# Altium project CompoundPeripheral.PrjPCB
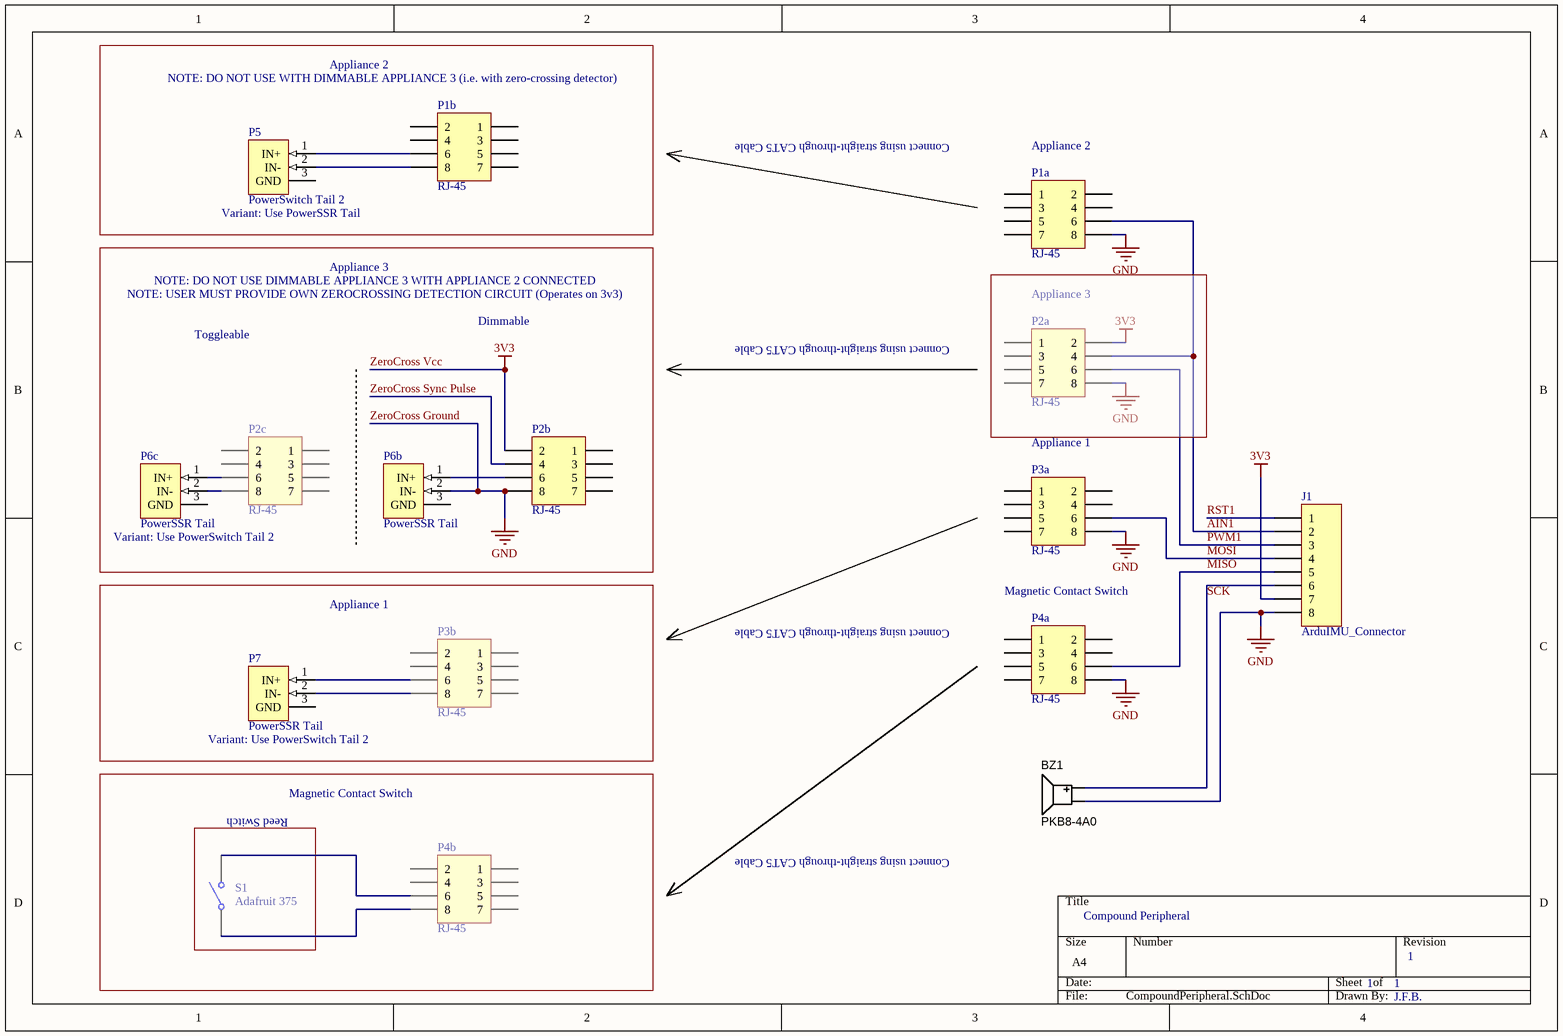
[diagram p0: CompoundPeripheral.SchDoc]
2 sheets, 30 parts. Net scope: global (net labels, ports and power ports of the same name join across sheets).
Sheets:
  CompoundPeripheral.SchDoc
  ZeroCrossDetector.SchDoc

## Sheet CompoundPeripheral.SchDoc: Compound Peripheral
size A4; DrawnBy: J.F.B.; Revision: 1; SheetNumber: 1; SheetTotal: 1

### Parts
BZ1  PKB8-4A0  [BUZZER_12.0X8.5MM]
J1  ArduIMU_Connector  [HDR1X8]
P1a  RJ-45  [HDR2X4]
P1b  RJ-45  [HDR2X4]
P2a  RJ-45  [HDR2X4]
P2b  RJ-45  [HDR2X4]
P2c  RJ-45  [HDR2X4]
P3a  RJ-45  [HDR2X4]
P3b  RJ-45  [HDR2X4]
P4a  RJ-45  [HDR2X4]
P4b  RJ-45  [HDR2X4]
P5  PowerSwitch Tail 2
P6b  PowerSSR Tail
P6c  PowerSSR Tail
P7  PowerSSR Tail
S1  Adafruit 375  [SPST-2]

### Blocks framed on the sheet
Appliance 3: P2a
Magnetic Contact Switch: P4b
Reed Switch: S1

### Nets
ZeroCross Ground: BZ1.2(Negative) J1.8 P1a.8 P2a.8 P2b.8 P3a.8 P4a.8 P6b.2(IN-)  [also labelled GND]
ZeroCross Vcc: J1.7 P2a.2 P2b.2  [also labelled 3V3]
AIN1: J1.2 P1a.6 P2a.4
MISO: J1.5 P4a.6
MOSI: J1.4 P3a.6
PWM1: J1.3 P2a.6
RST1: J1.1
SCK: BZ1.1(Positive) J1.6
ZeroCross Sync Pulse: P2b.4
NetP1b_6: P1b.6 P5.1(IN+)
NetP1b_8: P1b.8 P5.2(IN-)
NetP2b_6: P2b.6 P6b.1(IN+)
NetP2c_6: P2c.6 P6c.1(IN+)
NetP2c_8: P2c.8 P6c.2(IN-)
NetP3b_6: P3b.6 P7.1(IN+)
NetP3b_8: P3b.8 P7.2(IN-)
NetP4b_6: P4b.6 S1.2(NO)
NetP4b_8: P4b.8 S1.1(COMMON)

Not connected (* = marked no-connect by the designer): P1a 1 2 3 4 5 7; P1b 1 2 3 4 5 7; P2a 1 3 5 7; P2b 1 3 5 7; P2c 1 2 3 4 5 7; P3a 1 2 3 4 5 7; P3b 1 2 3 4 5 7; P4a 1 2 3 4 5 7; P4b 1 2 3 4 5 7; P5 3(GND); P6b 3(GND); P6c 3(GND); P7 3(GND)

### Notes on the sheet
- (near P1b) NOTE: DO NOT USE WITH DIMMABLE APPLIANCE 3 (i.e. with zero-crossing detector)
- Appliance 2
- Connect using straight-through CAT5 Cable
- (near P1a) Appliance 2
- (near P5) Variant: Use PowerSSR Tail
- NOTE: USER MUST PROVIDE OWN ZEROCROSSING DETECTION CIRCUIT (Operates on 3v3)
- NOTE: DO NOT USE DIMMABLE APPLIANCE 3 WITH APPLIANCE 2 CONNECTED
- Appliance 3
- Toggleable
- Dimmable
- Appliance 1
- Variant: Use PowerSwitch Tail 2
- Magnetic Contact Switch
- (near P7) Variant: Use PowerSwitch Tail 2

### Library data of the parts
BZ1 = BZ_12x8.5x6.5_2kHz: Speaker, Magnetic Transducer; Manufacturer 1: CUI Inc; Ratings: 2048 ±200 Hz; SCDType: source; Package / Case: 6.5mm pitch; Material: Noryl SE1-J; Supplier 1: Digi-Key; Supplier Part Number 1: 102-1152-ND; Manufacturer Part Number 1: PKB8-4A0
J1 = Header 8: Header, 8-Pin; LatestRevisionDate: 17-Jul-2002; LatestRevisionNote: Re-released for DXP Platform.; Publisher: Altium Limited
P1a P1b P2a P2b P2c P3a P3b P4a P4b = Header 4X2: Header, 4-Pin, Dual row; LatestRevisionDate: 17-Jul-2002; LatestRevisionNote: Re-released for DXP Platform.; Publisher: Altium Limited
S1 = SW-SPST: Single-Pole, Single-Throw Switch; Published: 24-Mar-1999; LatestRevisionDate: 17-Jul-2002; LatestRevisionNote: Re-released for DXP Platform.; PackageReference: SPST-2; Publisher: Altium Limited; PackageDescription: Switch; 2 Leads

## Sheet ZeroCrossDetector.SchDoc: Zero-Crossing Detector
size A4; DrawnBy: J.F.B.; Revision: 2; SheetNumber: 1; SheetTotal: 1
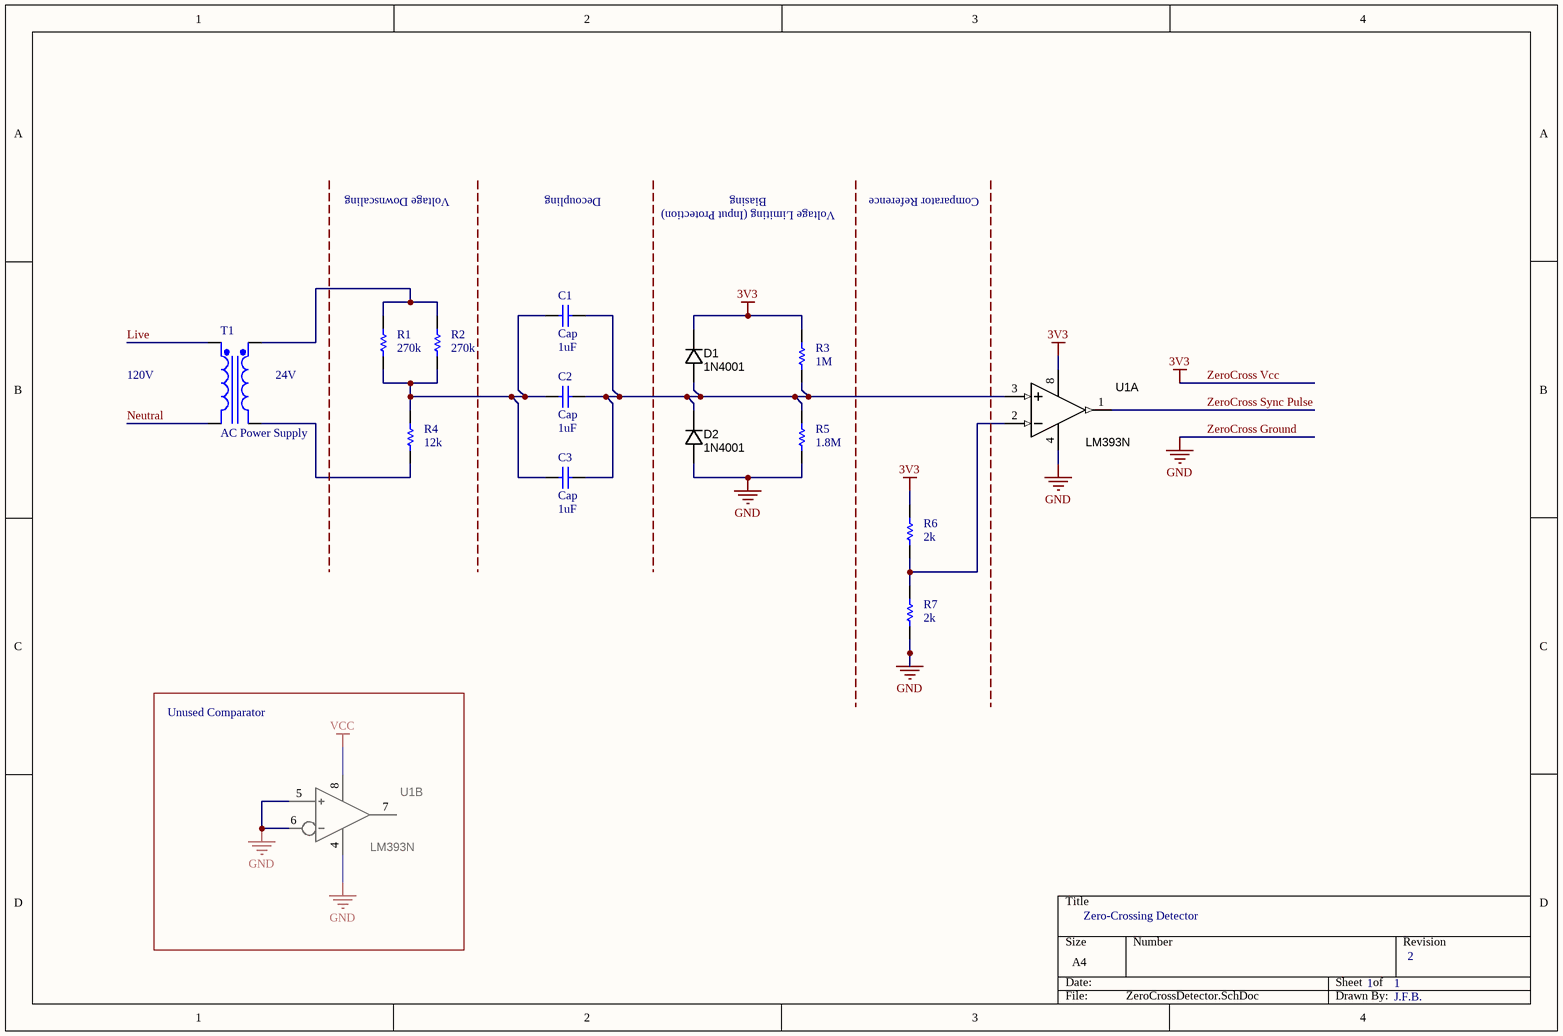
[diagram p1: ZeroCrossDetector.SchDoc]

### Parts
C1  Cap  value 1uF  [RAD-0.3]
C2  Cap  value 1uF  [RAD-0.3]
C3  Cap  value 1uF  [RAD-0.3]
D1  1N4001  [DO-41]
D2  1N4001  [DO-41]
R1  value 270k  [AXIAL-0.3]
R2  value 270k  [AXIAL-0.3]
R3  value 1M  [AXIAL-0.3]
R4  value 12k  [AXIAL-0.3]
R5  value 1.8M  [AXIAL-0.3]
R6  value 2k  [AXIAL-0.3]
R7  value 2k  [AXIAL-0.3]
T1  AC Power Supply  [TRF_4]
U1  LM393N  (parts A,B of 2)

### Blocks framed on the sheet
Unused Comparator: U1

### Nets
VCC: U1.8(+Vs)
ZeroCross Ground: D2.A R5.1 R7.1 U1.4(-Vs) U1.5(CIN_+) U1.6(CIN-)  [also labelled GND]
ZeroCross Vcc: D1.K R3.2 R6.2 U1.8(+Vs)  [also labelled 3V3]
Live: T1.1(Pri+)
Neutral: T1.2(Pri-)
ZeroCross Sync Pulse: U1.1(Aout)
NetC1_1: C1.1 C2.1 C3.1 R1.1 R2.1 R4.2
NetC1_2: C1.2 C2.2 C3.2 D1.A D2.K R3.1 R5.2 U1.3(AIN_+)
NetR1_2: R1.2 R2.2 T1.3(Sec+)
NetR4_1: R4.1 T1.4(Sec-)
NetR6_1: R6.1 R7.2 U1.2(AIN_-)

Not connected (* = marked no-connect by the designer): U1 7(Cout)

### Notes on the sheet
- Voltage Downscaling
- Decoupling
- Biasing
- Voltage Limiting (Input Protection)
- Comparator Reference
- 120V
- (near T1) 24V

### Library data of the parts
C1-C3 = Cap: Capacitor; Published: 8-Jun-2000; LatestRevisionDate: 17-Jul-2002; LatestRevisionNote: Re-released for DXP Platform.; PackageReference: RAD-0.3; Publisher: Altium Limited; PackageDescription: Radial Cap, Thru-Hole; 2 Leads; 0.3 in Pin Spacing
D1 D2 = DIODE_1N4007_1000V_1.0A_DO-41: Diode 1N4007 1A 1000V THD; Manufacturer 1: Diodes Inc; Manufacturer Part Number 1: 1N4007-T; Ratings: 100V; 1.5A; Diode Type: Standard; Value: Vf = 1.15V @ 1.5A (Max); SCDType: spec; Package / Case: DO-41; Mounting Type: Through Hole
R1-R7 = Res1: Resistor; Published: 8-Jun-2000; LatestRevisionDate: 17-Jul-2002; LatestRevisionNote: Re-released for DXP Platform.; PackageReference: AXIAL-0.3; Publisher: Altium Limited; PackageDescription: Axial Device, Thru-Hole; 2 Leads; 0.3 in Pin Spacing
T1 = Trans Ideal: Transformer (Ideal); Published: 8-Jun-2000; LatestRevisionDate: 17-Jul-2002; LatestRevisionNote: Re-released for DXP Platform.; PackageReference: TRF_4; Publisher: Altium Limited; PackageDescription: Transformer; 4 Leads
U1 = IC_AMP+COMPAR_TLV2702: Fairchild LM393N Comparator; Manufacturer 1: Fairchild Semiconductor; Voltage - Supply: 2 V ~ 36 V, ±1 V ~ 18 V; SCDType: undef; Manufacturer Part Number 1: LM393N; Package / Case: 8-DIP; Supplier 1: Digi-Key; Supplier Part Number 1: LM393NFS-ND

## Nets that join several sheets
ZeroCross Ground: CompoundPeripheral (8 pins), ZeroCrossDetector (6 pins)
ZeroCross Vcc: CompoundPeripheral (J1.7 P2a.2 P2b.2), ZeroCrossDetector (D1.K R3.2 R6.2 U1.8)
ZeroCross Sync Pulse: CompoundPeripheral (P2b.4), ZeroCrossDetector (U1.1)